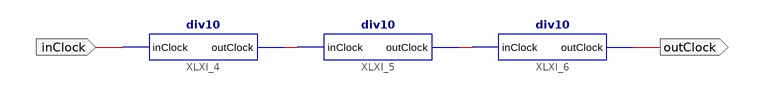
[diagram p0: schematic sheet 1]
// Xilinx ISE schematic Clock.sch (spartan6) as structural Verilog: 3 symbols, 2 ports
module Clock (
  input  inClock,
  output outClock
);

  wire XLXN_4, XLXN_5;

  div10 XLXI_4 (.inClock(inClock), .outClock(XLXN_4));
  div10 XLXI_5 (.inClock(XLXN_4), .outClock(XLXN_5));
  div10 XLXI_6 (.inClock(XLXN_5), .outClock(outClock));
endmodule
